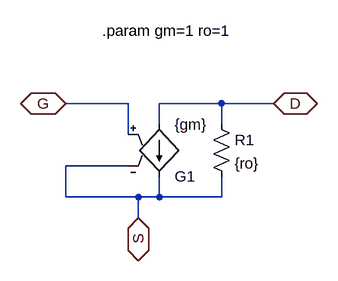
[diagram p0: schematic nmos_small_signal.asc]
nmos_small_signal.asc, the LTspice schematic file:
Version 4
SHEET 1 880 680
WIRE 80 64 -16 64
WIRE 224 64 128 64
WIRE 304 64 224 64
WIRE 128 96 128 64
WIRE 224 96 224 64
WIRE 80 112 80 64
WIRE 80 160 -16 160
WIRE -16 208 -16 160
WIRE 96 208 -16 208
WIRE 128 208 128 176
WIRE 128 208 96 208
WIRE 224 208 224 176
WIRE 224 208 128 208
WIRE 96 240 96 208
FLAG -16 64 G
IOPIN -16 64 BiDir
FLAG 304 64 D
IOPIN 304 64 BiDir
FLAG 96 240 S
IOPIN 96 240 BiDir
SYMBOL g2 128 192 M180
SYMATTR InstName G1
SYMATTR Value {gm}
SYMBOL res 208 80 R0
SYMATTR InstName R1
SYMATTR Value {ro}
TEXT 40 -48 Left 2 !.param gm=1 ro=1

The netlist it stands for:
* nmos_small_signal.asc
G1 D S G S {gm}
R1 D S {ro}
.param gm=1 ro=1
.backanno
.end